# EAGLE design line5.2.2 (EAGLE 8.0.1)
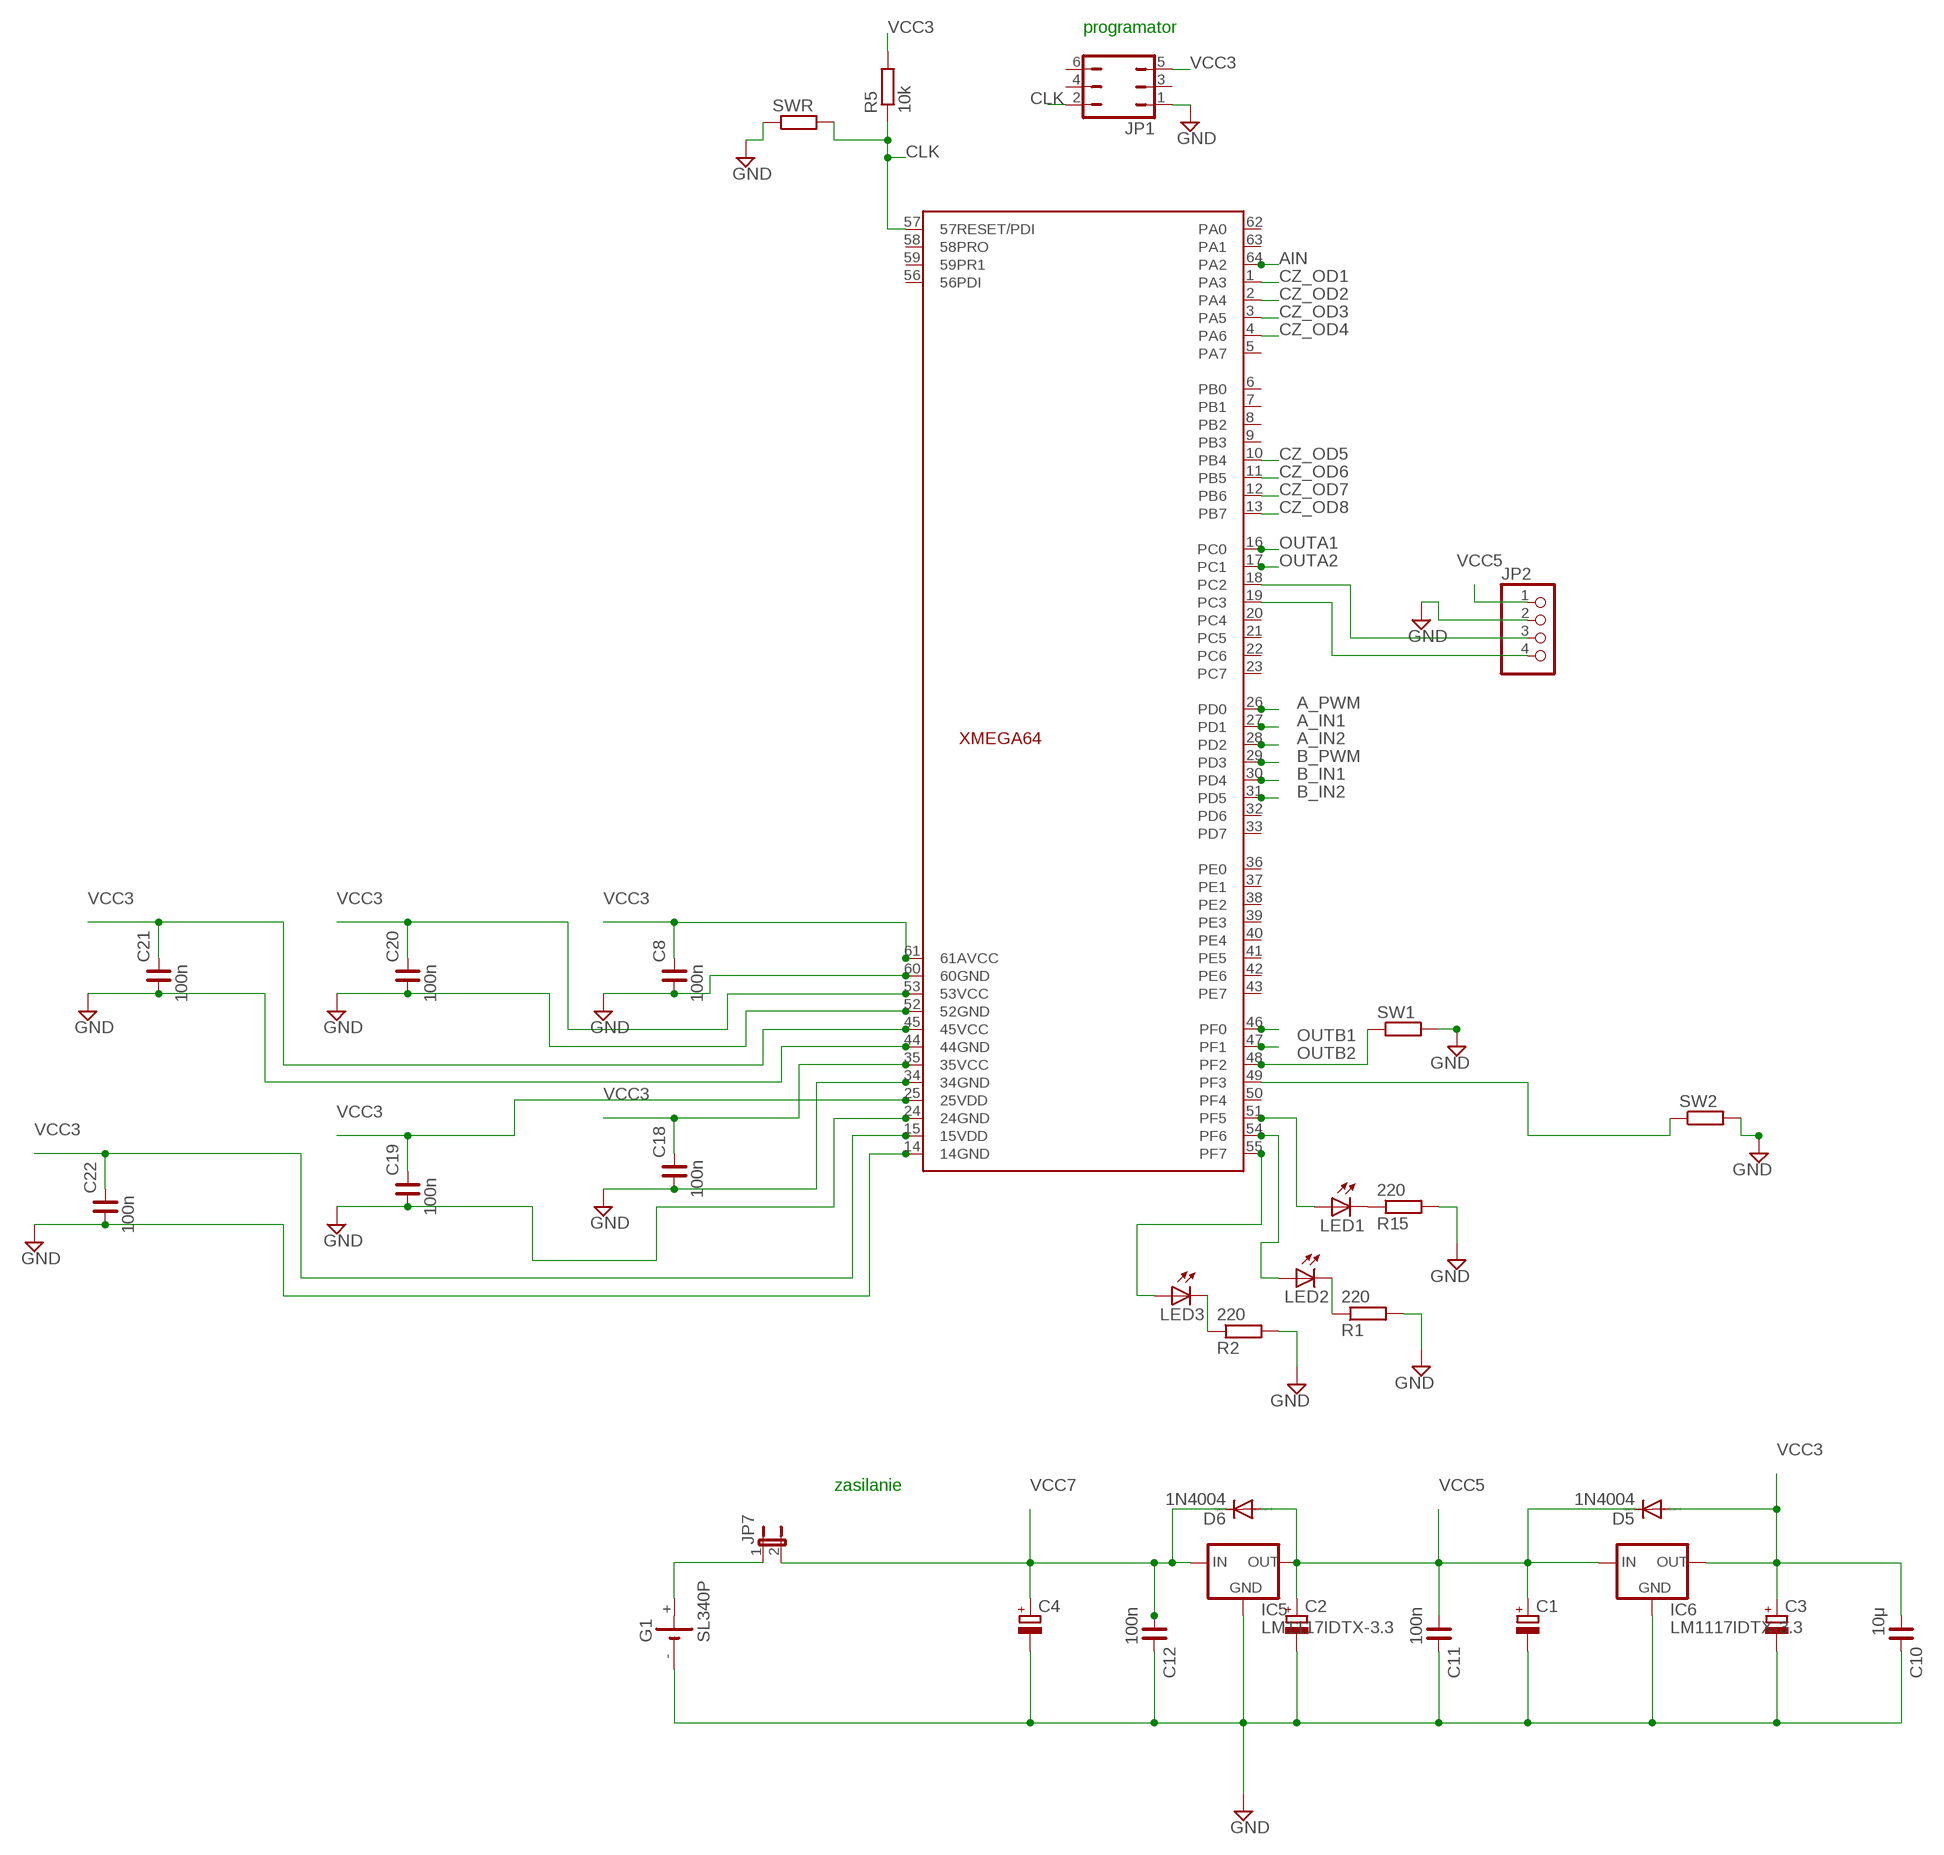
[diagram p0: schematic, sheet 1, part 1 of 2]
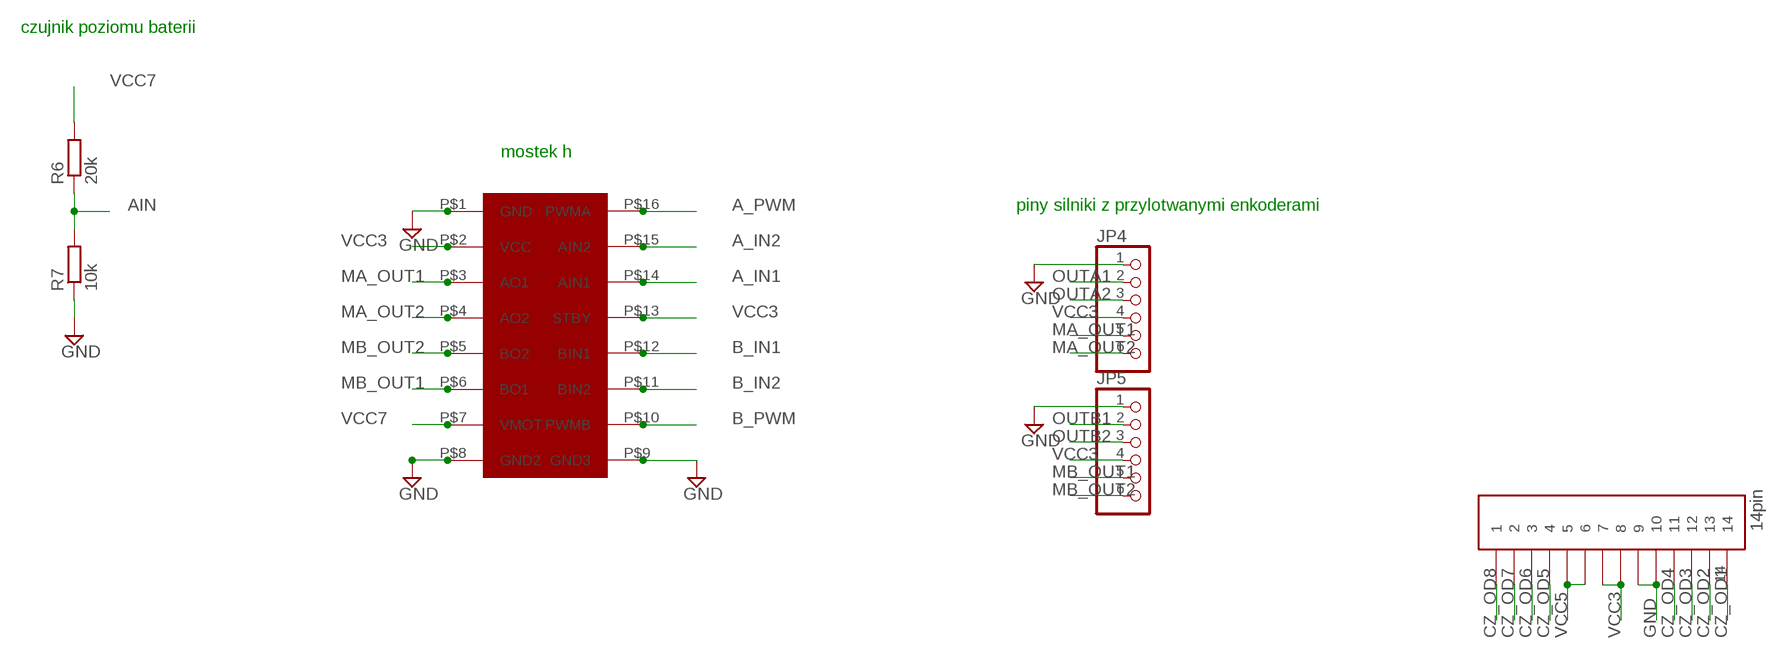
[diagram p1: schematic, sheet 1, part 2 of 2]

## Parts
C1  CPOL-EU153CLV-0810  [153CLV-0810]
C2  CPOL-EU153CLV-0810  [153CLV-0810]
C3  CPOL-EU153CLV-0810  [153CLV-0810]
C4  CPOL-EU153CLV-0810  [153CLV-0810]
C8  100n  C_1206  [C1206]
C10  10μ  C_1206  [C1206]
C11  100n  C_1206  [C1206]
C12  100n  C_1206  [C1206]
C18  100n  C_1206  [C1206]
C19  100n  C_1206  [C1206]
C20  100n  C_1206  [C1206]
C21  100n  C_1206  [C1206]
C22  100n  C_1206  [C1206]
D5  1N4004  [DO41-10]
D6  1N4004  [DO41-10]
G1  SL340P  [SL-340/P3.6V]
IC5  LM1117IDTX-3.3  [TO252]
IC6  LM1117IDTX-3.3  [TO252]
JP1  JP3Q  [JP3Q]
JP2  PINHD-1X4  [1X04]
JP4  PINHD-1X6  [1X06]
JP5  PINHD-1X6  [1X06]
JP7  JP1E  [JP1]
LED1  LEDSMT1206  [1206]
LED2  LEDSMT1206  [1206]
LED3  LEDSMT1206  [1206]
R1  220  R-EU_R0805  [R0805]
R2  220  R-EU_R0805  [R0805]
R5  10k  R-EU_R0805  [R0805]
R6  20k  R-EU_R0805  [R0805]
R7  10k  R-EU_R0805  [R0805]
R15  220  R-EU_R0805  [R0805]
SW1  R-EU_R1206  [R1206]
SW2  R-EU_R1206  [R1206]
SWR  R-EU_R1206  [R1206]
U$1  POLULU713  [POLULU713]
U$2  14PIN  [14PIN]
XMEGA64  XMEGA64C3TQFP64  [TQFP64]

## Nets
A_IN1: U$1.P$14(AIN1) XMEGA64.27(PD1)
A_IN2: U$1.P$15(AIN2) XMEGA64.28(PD2)
A_PWM [zasilanie]: U$1.P$16(PWMA) XMEGA64.26(PD0)
AIN: R6.1 R7.2 XMEGA64.64(PA2)
B_IN1: U$1.P$12(BIN1) XMEGA64.30(PD4)
B_IN2: U$1.P$11(BIN2) XMEGA64.31(PD5)
B_PWM [zasilanie]: U$1.P$10(PWMB) XMEGA64.29(PD3)
CLK: JP1.2 R5.1 SWR.2 XMEGA64.57(57RESET/PDI)
CZ_OD1: U$2.14 XMEGA64.1(PA3)
CZ_OD2: U$2.13 XMEGA64.2(PA4)
CZ_OD3: U$2.12 XMEGA64.3(PA5)
CZ_OD4: U$2.11 XMEGA64.4(PA6)
CZ_OD5: U$2.4 XMEGA64.10(PB4)
CZ_OD6: U$2.3 XMEGA64.11(PB5)
CZ_OD7: U$2.2 XMEGA64.12(PB6)
CZ_OD8: U$2.1 XMEGA64.13(PB7)
GND [zasilanie]: C1.- C2.- C3.- C4.- C8.1 C10.2 C11.2 C12.2 C18.1 C19.1 C20.1 C21.1 C22.1 G1.- IC5.1(GND) IC6.1(GND) JP1.1 JP2.2 JP4.1 JP5.1 R1.2 R2.2 R7.1 R15.2 SW1.2 SW2.2 SWR.1 U$1.P$1(GND) U$1.P$8(GND2) U$1.P$9(GND3) U$2.9 U$2.10 XMEGA64.14(14GND) XMEGA64.24(24GND) XMEGA64.34(34GND) XMEGA64.44(44GND) XMEGA64.52(52GND) XMEGA64.60(60GND)
MA_OUT1 [zasilanie]: JP4.5 U$1.P$3(AO1)
MA_OUT2 [zasilanie]: JP4.6 U$1.P$4(AO2)
MB_OUT1 [zasilanie]: JP5.5 U$1.P$6(BO1)
MB_OUT2 [zasilanie]: JP5.6 U$1.P$5(BO2)
N$1: LED1.A XMEGA64.51(PF5)
N$3: SW2.1 XMEGA64.49(PF3)
N$4: JP2.4 XMEGA64.19(PC3)
N$5: JP2.3 XMEGA64.18(PC2)
N$6: LED2.C R1.1
N$7: LED2.A XMEGA64.54(PF6)
N$8: LED3.C R2.1
N$9: LED3.A XMEGA64.55(PF7)
N$18 [zasilanie]: G1.+ JP7.1
N$26: LED1.C R15.1
OUTA1: JP4.2 XMEGA64.16(PC0)
OUTA2: JP4.3 XMEGA64.17(PC1)
OUTB1: JP5.2 XMEGA64.46(PF0)
OUTB2: JP5.3 XMEGA64.47(PF1)
SW!: SW1.1 XMEGA64.48(PF2)
VCC3 [zasilanie]: C3.+ C8.2 C10.1 C18.2 C19.2 C20.2 C21.2 C22.2 D5.A IC6.TAB(OUT) JP1.5 JP4.4 JP5.4 R5.2 U$1.P$2(VCC) U$1.P$13(STBY) U$2.7 U$2.8 XMEGA64.15(15VDD) XMEGA64.25(25VDD) XMEGA64.35(35VCC) XMEGA64.45(45VCC) XMEGA64.53(53VCC) XMEGA64.61(61AVCC)
VCC5 [zasilanie]: C1.+ C2.+ C11.1 D5.C D6.A IC5.TAB(OUT) IC6.2(IN) JP2.1 U$2.5 U$2.6
VCC7 [zasilanie]: C4.+ C12.1 D6.C IC5.2(IN) JP7.2 R6.2 U$1.P$7(VMOT)
Unconnected: JP1.3 JP1.4 JP1.6 XMEGA64.5(PA7) XMEGA64.6(PB0) XMEGA64.7(PB1) XMEGA64.8(PB2) XMEGA64.9(PB3) XMEGA64.20(PC4) XMEGA64.21(PC5) XMEGA64.22(PC6) XMEGA64.23(PC7) XMEGA64.32(PD6) XMEGA64.33(PD7) XMEGA64.36(PE0) XMEGA64.37(PE1) XMEGA64.38(PE2) XMEGA64.39(PE3) XMEGA64.40(PE4) XMEGA64.41(PE5) XMEGA64.42(PE6) XMEGA64.43(PE7) XMEGA64.50(PF4) XMEGA64.56(56PDI) XMEGA64.58(58PRO) XMEGA64.59(59PR1) XMEGA64.62(PA0) XMEGA64.63(PA1)

## Notes on the sheet
- programator
- czujnik poziomu baterii
- mostek h
- piny silniki z przylotwanymi enkoderami
- zasilanie

## Library data of the parts
C1-C4 = rcl:CPOL-EU: POLARIZED CAPACITOR, European symbol
C8 C10-C12 C18-C22 = rc-master-smd:C_: NON-POLARIZED CAP
D5 D6 = diode:1N4004: DIODE general purpose rectifier, 1 A
G1 = battery:SL340P: LI BATTERY Sonnenschein SL-340 P 3.6 V
IC5 IC6 = lm1117:LM1117IDTX-*
JP1 = jumper:JP3Q: JUMPER
JP2 = pinhead:PINHD-1X4: PIN HEADER
JP4 JP5 = pinhead:PINHD-1X6: PIN HEADER
JP7 = jumper:JP1E: JUMPER
LED1-LED3 = led:LED: LED OSRAM: - CHIPLED LG R971, LG N971, LY N971, LG Q971, LY Q971, LO R971, LY R971 LH N974, LH R974 LS Q976, LO Q976, LY Q976 LO Q996 - Hyper CHIPLED LW Q18S LB Q993, LB Q99A, LB R99A - SideLED LS A670, LO A670, LY A670, LG A670, LP A670 LB A673, LV A673, LT A673, LW A673 LH A674 LY A675 LS A676, LA A676, LO A676, LY A676, LW A676 LS A679, LY A679, LG A679 - Hyper Micro SIDELED® LS Y876, LA Y876, LO Y876, LY Y876 LT Y87S - SmartLED LW L88C, LW L88S LB L89C, LB L89S, LG L890 LS L89K, LO L89K, LY L89K LS L896, LA L896, LO L896, LY L896 - TOPLED LS T670, LO T670, LY T670, LG T670, LP T670 LSG T670, LSP T670, LSY T670, LOP T670, LYG T670 LG T671, LOG T671, LSG T671 LB T673, LV T673, LT T673, LW T673 LH T674 LS T676, LA T676, LO T676, LY T676, LB T676, LH T676, LSB T676, LW T676 LB T67C, LV T67C, LT T67C, LS T67K, LO T67K, LY T67K, LW E67C LS E67B, LA E67B, LO E67B, LY E67B, LB E67C, LV E67C, LT E67C LW T67C LS T679, LY T679, LG T679 LS T770, LO T770, LY T770, LG T770, LP T770 LB T773, LV T773, LT T773, LW T773 LH T774 LS E675, LA E675, LY E675, LS T675 LS T776, LA T776, LO T776, LY T776, LB T776 LHGB T686 LT T68C, LB T68C - Hyper Mini TOPLED® LB M676 - Mini TOPLED Santana® LG M470 LS M47K, LO M47K, LY M47K Source: http://www.osram.convergy.de LUXEON: - LUMILED® LXK2-PW12-R00, LXK2-PW12-S00, LXK2-PW14-U00, LXK2-PW14-V00 LXK2-PM12-R00, LXK2-PM12-S00, LXK2-PM14-U00 LXK2-PE12-Q00, LXK2-PE12-R00, LXK2-PE12-S00, LXK2-PE14-T00, LXK2-PE14-U00 LXK2-PB12-K00, LXK2-PB12-L00, LXK2-PB12-M00, LXK2-PB14-N00, LXK2-PB14-P00, LXK2-PB14-Q00 LXK2-PR12-L00, LXK2-PR12-M00, LXK2-PR14-Q00, LXK2-PR14-R00 LXK2-PD12-Q00, LXK2-PD12-R00, LXK2-PD12-S00 LXK2-PH12-R00, LXK2-PH12-S00 LXK2-PL12-P00, LXK2-PL12-Q00, LXK2-PL12-R00 Source: www.luxeon.com KINGBRIGHT: KA-3528ASYC Source: www.kingbright.com
R1 R2 R5-R7 R15 SW1 SW2 SWR = rcl:R-EU_: RESISTOR, European symbol
U$1 = polulu:POLULU713
U$2 = ffc_fcp(1):14PIN
XMEGA64 = atmega-atxmega:XMEGA64C3: High-performance, low-power Atmel® AVR® XMEGA® 8/16-bit Microcontroller  Nonvolatile program and data memories  64K - 256KBytes of In-System Self-Programmable Flash  4K - 8KBytes Boot Code Section with Independent Lock Bits  2K - 4KBytes EEPROM  4K - 16KBytes Internal SRAM  Peripheral features  Four-channel event system  Five 16-bit timer/counters  Four timer/counters with four output compare or input capture channels  One timer/counter with two output compare or input capture channels  High resolution extension on two timer/counters  Advanced waveform extension (AWeX) on one timer/counter  One USB device interface  USB 2.0 full speed (12Mbps) and low speed (1.5Mbps) device compliant  32 Endpoints with full configuration flexibility  Three USARTs with IrDA support for one USART  Two two-wire interfaces with dual address match (I2C and SMBus compatible)  Two serial peripheral interfaces (SPIs)  CRC-16 (CRC-CCITT) and CRC-32 (IEEE®802.3) generator  16-bit real time counter (RTC) with separate oscillator  One sixteen-channel, 12-bit, 300ksps Analog to Digital Converter  Two Analog Comparators with window compare function, and current sources  External interrupts on all general purpose I/O pins  Programmable watchdog timer with separate on-chip ultra low power oscillator  QTouch® library support  Capacitive touch buttons, sliders and wheels  Special microcontroller features  Power-on reset and programmable brown-out detection  Internal and external clock options with PLL and prescaler  Programmable multilevel interrupt controller  Five sleep modes  Programming and debug interface  PDI (program and debug interface)  I/O and packages  50 programmable I/O pins  64-lead TQFP  64-pad QFN  Operating voltage  1.6 – 3.6V  Operating frequency  0 – 12MHz from 1.6V  0 – 32MHz from 2.7V

## Net classes
0 default: width 0.305 mm
1 zasilanie: width 0.406 mm

## Board
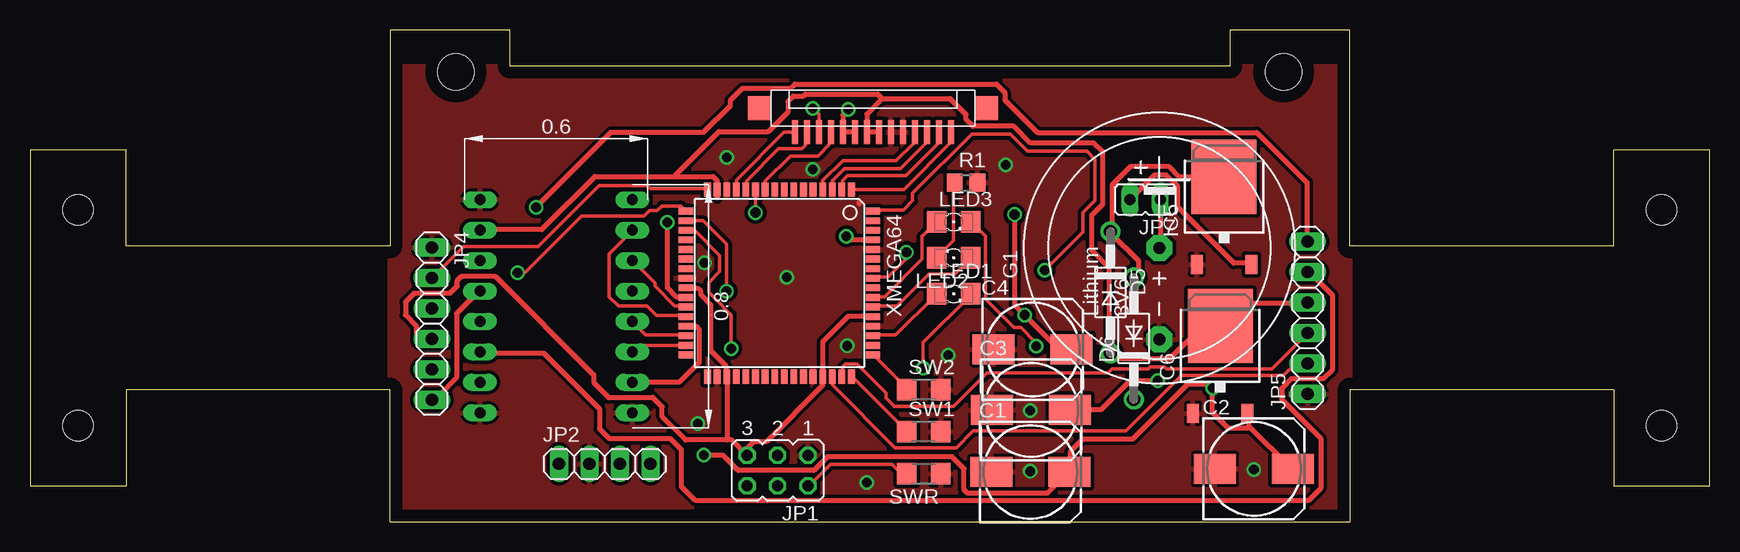
[diagram p2: board, top side]
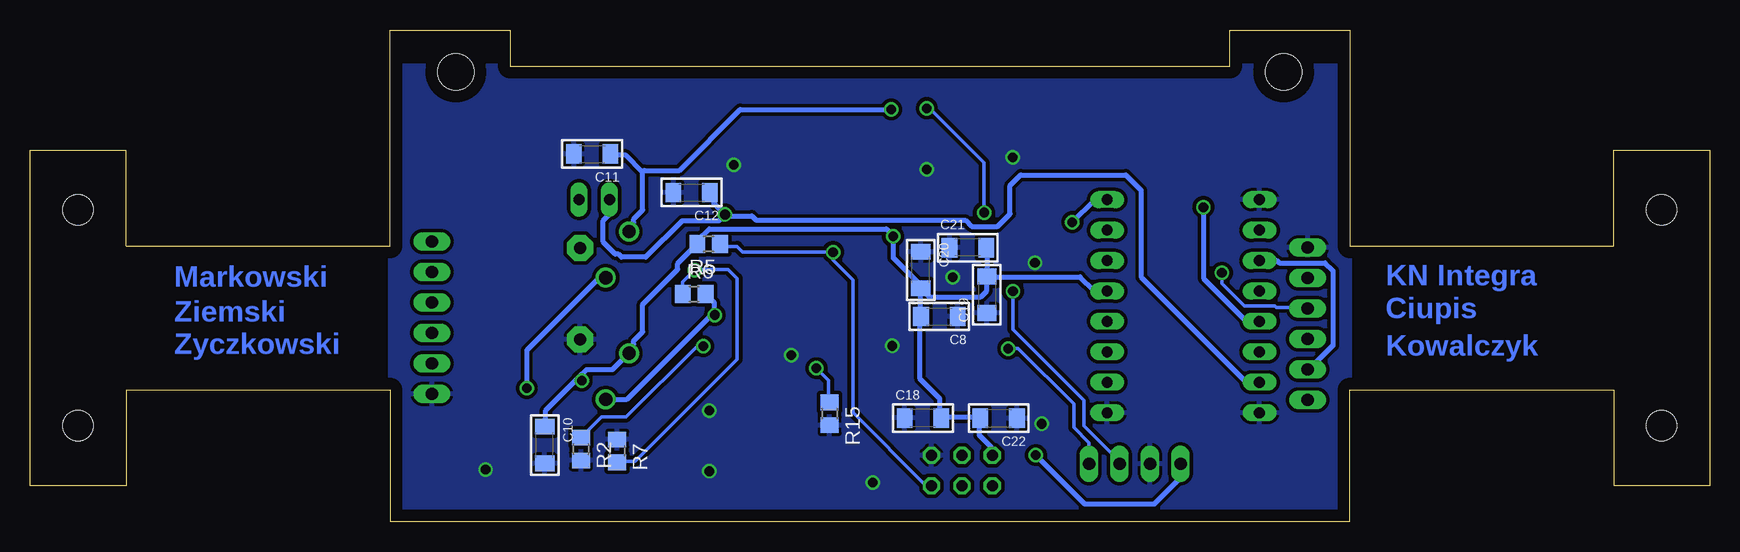
[diagram p3: board, bottom side, seen from below]

Size 140 x 41 mm. Coordinates in mm from the lower left corner, seen from the top.
Outline: 0,3 8,3 8,11 30,11 30,0 110,0 110,11 132,11 132,3 140,3 140,31 132,31 132,23 110,23 110,41 100,41 100,38 40,38 40,41 30,41 30,23 8,23 8,31 0,31 0,3
Copper layers (1*16): Top 0.035mm / dielectric 1.5mm / Bottom 0.035mm
Design rules "default": minimum track width 10mil, minimum drill 24mil, track to track 8mil, track to pad 8mil, pad to pad 8mil, via to via 8mil, smd to smd 8mil, copper to edge 40mil, drill to drill 8mil, minimum pad ring 10mil, minimum via ring 8mil, stop-mask expansion 4mil, vias tented up to drill 0mil, thermal gap 10mil
Holes 2.5 mm at 4,8 4,26 136,8 136,26
Holes 3 mm at 35.5,37.5 104.5,37.5

### Footprints (pad centres in the part's own frame; a part is rotated, then mirrored left to right if it is on the bottom)
153CLV-0810 = smd 3.5 x 2.5: + 3.25,0; - -3.25,0
C1206 = smd 1.3 x 1.6: 1 -1.524,0; 2 1.524,0
DO41-10 = drill 1.118: A 5.08,0; C -5.08,0
SL-340/P3.6V = drill 1.016 pad 2.159 octagon: + 0,0; - -7.62,0
TO252 = smd 1 x 1.6: 1 -2.28,-4.8; 2 2.28,-4.8 | smd 5.4 x 6.2: TAB 0,2.5
JP3Q = drill 0.914 octagon: 1 -2.54,-1.27; 2 -2.54,1.27; 3 0,-1.27; 4 0,1.27; 5 2.54,-1.27; 6 2.54,1.27
1X04 = drill 1.016 long: 1 -3.81,0; 2 -1.27,0; 3 1.27,0; 4 3.81,0
1X06 = drill 1.016 long: 1 -6.35,0; 2 -3.81,0; 3 -1.27,0; 4 1.27,0; 5 3.81,0; 6 6.35,0
JP1 = drill 0.914 long: 1 0,-1.27; 2 0,1.27
1206 = smd 1.6 x 1.803: A -1.422,0; C 1.422,0
R0805 = smd 1.3 x 1.5: 1 -0.95,0; 2 0.95,0
R1206 = smd 1.6 x 1.803: 1 -1.422,0; 2 1.422,0
POLULU713 = drill 0.9 long: P$1 -13.97,3.81; P$2 -13.97,1.27; P$3 -13.97,-1.27; P$4 -13.97,-3.81; P$5 -13.97,-6.35; P$6 -13.97,-8.89; P$7 -13.97,-11.43; P$8 -13.97,-13.97; P$9 -1.27,-13.97; P$10 -1.27,-11.43; P$11 -1.27,-8.89; P$12 -1.27,-6.35; P$13 -1.27,-3.81; P$14 -1.27,-1.27; P$15 -1.27,1.27; P$16 -1.27,3.81
14PIN = smd 2 x 0.5: 1 -1.5,6.23; 2 -1.5,5.23; 3 -1.5,4.23; 4 -1.5,3.23; 5 -1.5,2.23; 6 -1.5,1.23; 7 -1.5,0.23; 8 -1.5,-0.77; 9 -1.5,-1.77; 10 -1.5,-2.77; 11 -1.5,-3.77; 12 -1.5,-4.77; 13 -1.5,-5.77; 14 -1.5,-6.77 | smd 2 x 1.8: 19 0.5,9.23; 20 0.5,-9.77
TQFP64 = smd 1.194 x 0.559: 1 -7.8,6; 2 -7.8,5.2; 3 -7.8,4.4; 4 -7.8,3.6; 5 -7.8,2.8; 6 -7.8,2; 7 -7.8,1.2; 8 -7.8,0.4; 9 -7.8,-0.4; 10 -7.8,-1.2; 11 -7.8,-2; 12 -7.8,-2.8; 13 -7.8,-3.6; 14 -7.8,-4.4; 15 -7.8,-5.2; 16 -7.8,-6; 33 7.8,-6; 34 7.8,-5.2; 35 7.8,-4.4; 36 7.8,-3.6; 37 7.8,-2.8; 38 7.8,-2; 39 7.8,-1.2; 40 7.8,-0.4; 41 7.8,0.4; 42 7.8,1.2; 43 7.8,2; 44 7.8,2.8; 45 7.8,3.6; 46 7.8,4.4; 47 7.8,5.2; 48 7.8,6 | smd 0.559 x 1.194: 17 -6,-7.8; 18 -5.2,-7.8; 19 -4.4,-7.8; 20 -3.6,-7.8; 21 -2.8,-7.8; 22 -2,-7.8; 23 -1.2,-7.8; 24 -0.4,-7.8; 25 0.4,-7.8; 26 1.2,-7.8; 27 2,-7.8; 28 2.8,-7.8; 29 3.6,-7.8; 30 4.4,-7.8; 31 5.2,-7.8; 32 6,-7.8; 49 6,7.8; 50 5.2,7.8; 51 4.4,7.8; 52 3.6,7.8; 53 2.8,7.8; 54 2,7.8; 55 1.2,7.8; 56 0.4,7.8; 57 -0.4,7.8; 58 -1.2,7.8; 59 -2,7.8; 60 -2.8,7.8; 61 -3.6,7.8; 62 -4.4,7.8; 63 -5.2,7.8; 64 -6,7.8

### Placement (x,y rotation side)
C1  83.39,4.13 0 top
C2  102.03,4.39 0 top
C3  83.45,9.32 0 top
C4  83.58,14.36 0 top
C8  64.2,17.1 180 bottom
C10  97.09,6.38 270 bottom
C11  93.14,30.66 180 bottom
C12  84.85,27.45 180 bottom
C18  65.56,8.63 0 bottom
C19  60.24,18.92 90 bottom
C20  65.75,20.97 270 bottom
C21  61.83,22.84 0 bottom
C22  59.25,8.62 180 bottom
D5  90.06,19.11 270 top
D6  92.02,15.27 90 top
G1  94.14,22.81 90 top
IC5  99.53,26.25 0 top
IC6  99.22,13.81 0 top
JP1  62.33,4.26 180 top
JP2  47.9,4.81 0 top
JP4  33.5,16.5 270 top
JP5  106.5,17 90 top
JP7  92.98,26.86 90 top
LED1  77,19 0 top
LED2  77,22 180 top
LED3  77,25 0 top
R1  78.03,28.26 0 top
R2  94.08,6.05 270 bottom
R5  83.43,23.14 180 bottom
R6  84.64,18.98 0 bottom
R7  91.06,5.89 270 bottom
R15  73.35,8.99 270 bottom
SW1  74.5,7.5 0 top
SW2  74.5,11 0 top
SWR  74.5,4 180 top
U$1  51.48,23.04 0 top
U$2  70,34 90 top
XMEGA64  62.48,19.89 270 top

### Tracks (layer width: path | path; a pad name or v marks a point on that pad's centre or on a via)
A_IN1
  Top 0.305: XMEGA64.27 54.63,17.99 53.74,17.99 52.09,19.64 52.09,19.89 50.31,21.67 U$1.P$14
A_IN2
  Top 0.305: 54.63,17.1 XMEGA64.28 54.6,17.17 52.22,17.17 51.43,17.96 49.07,17.96 48.28,18.75 48.28,22.3 50.19,24.21 U$1.P$15
A_PWM  (via drill 0.8)
  Top 0.406: v53.11,24.97 53.11,19.51 53.87,18.75 54.63,18.75 XMEGA64.26
  Bottom 0.406: v53.11,24.97 51.33,26.75 50.31,26.75 U$1.P$16
AIN  (via drill 0.8)
  Top 0.305: XMEGA64.64 70.38,25.99 72.79,25.99 73.58,26.77 73.58,27.39 78.51,32.32 81.72,32.32 83.16,30.88 88.09,30.88 88.77,30.2 88.77,26.78 87.78,25.79 87.78,24.16 v84.59,20.97
  Bottom 0.305: R7.2 90.95,5.03 89.56,5.03 81.05,13.54 81.05,20.27 81.81,21.03 84.52,21.03 v84.59,20.97 85.59,19.96 R6.1
B_IN1
  Top 0.305: XMEGA64.30 54.63,15.57 51.33,15.57 50.31,16.59 U$1.P$12
B_IN2
  Top 0.305: XMEGA64.31 54.63,14.68 50.82,14.68 50.31,14.18 U$1.P$11
B_PWM
  Top 0.406: XMEGA64.29 54.75,16.3 55.51,16.3 55.78,16.03 55.78,13.28 54.13,11.64 50.31,11.64 U$1.P$10
CLK  (via drill 0.8)
  Top 0.305: 73.05,3.89 SWR.2 72.65,4 71.87,4.78 66.73,4.78 64.94,2.99 JP1.2 | XMEGA64.57 70.38,20.4 71.52,20.4 73.06,21.93 v73.06,22.47
  Bottom 0.305: R5.1 82.45,23.07 82.32,22.94 81.05,22.94 80.58,22.47 v73.06,22.47 73.06,21.81 71.4,20.14 71.4,9.1 65.3,3 64.92,3 JP1.2
CZ_OD1
  Top 0.305: 68.6,27.77 XMEGA64.1 72.83,27.7 76.77,31.63 76.73,32.46 U$2.14
CZ_OD2
  Top 0.305: XMEGA64.2 67.71,27.77 67.71,28.45 68.13,28.87 73.01,28.87 75.72,31.57 75.72,32.46 U$2.13
CZ_OD3
  Top 0.305: XMEGA64.3 66.89,27.75 66.89,28.44 66.9,28.44 67.9,29.44 72.56,29.44 74.7,31.57 74.7,32.46 U$2.12
CZ_OD4
  Top 0.305: 66.08,27.73 XMEGA64.4 66.08,28.41 66.07,28.42 67.77,30.12 72.19,30.12 72.21,30.1 73.68,31.57 73.68,32.46 U$2.11
CZ_OD5
  Top 0.305: XMEGA64.10 61.27,27.75 61.27,28.38 63.39,30.5 65.68,30.5 66.7,31.52 66.7,32.46 U$2.4
CZ_OD6  (via drill 0.8)
  Top 0.305: v60.48,25.77 60.48,27.64 XMEGA64.11 | 65.77,33.41 65.77,32.65 U$2.3 65.77,33.97 65.27,34.47 v65.24,34.47
  Bottom 0.305: v60.48,25.77 60.48,29.92 65.02,34.47 v65.24,34.47
CZ_OD7
  Top 0.305: XMEGA64.12 59.71,27.77 59.71,28.4 62.4,31.09 64.35,31.09 64.67,31.41 64.67,32.46 U$2.2
CZ_OD8
  Top 0.305: 58.95,27.77 XMEGA64.13 58.88,28.48 62.87,32.46 63.65,32.46 U$2.1
GND  (via drill 0.8)
  Top 0.406: 69.12,26.67 69.11,26.51
  other vias: 56.23,21.59 58.09,30.38 65.24,29.37 68.12,14.65 76.53,13.88 83.36,9.24 83.39,4.19 69.74,3.26 102.02,4.34 55.67,8.15 81.32,29.74 63.08,20.37
  pour Bottom (isolate 0.305): 30,38 110,38 110,0 30,0
  pour Top (isolate 0.305): 31,33 56,33 56,37 84,37 84,33 109,33 109,1 31,1
  pour Top (isolate 0.305): 30,38 110,38 110,0 30,0
MA_OUT1
  Bottom 0.406: 37.49,21.67 U$1.P$3 36.06,21.77 35.87,21.57 32.04,21.57 31.39,20.92 31.39,14.68 33.42,12.65 JP4.5
MA_OUT2
  Top 0.406: 37.49,19.13 U$1.P$4 37.45,19.23 35.56,17.34 35.56,12.01 34,10.45 33.8,10.45 JP4.6 33.55,10.11
MB_OUT1
  Top 0.406: U$1.P$6 37.62,14.05 42.82,14.05 47.46,9.41 47.46,7.75 48.27,6.94 53.36,6.94 54.3,6 54.3,2.91 55.48,1.73 106.55,1.73 107.6,2.78 107.6,6.92 104.35,10.17 104.35,11.12 105.15,11.92 107.83,11.92 108.56,12.65 108.59,12.65 108.59,18.87 106.65,20.81 JP5.5 106.58,20.78
MB_OUT2  (via drill 0.8)
  Top 0.406: JP5.6 106.45,23.45 106.45,28.27 106.44,28.27 102.27,32.44 83.98,32.44 81.27,35.15 81.27,35.79 80.56,36.49 63.76,36.49 63.41,36.14 59.38,36.14 58.38,35.14 58.38,34.69 56.16,32.46 48.43,32.46 v42.19,26.22
  Bottom 0.406: v42.19,26.22 42.19,20.27 38.63,16.72 37.62,16.72 U$1.P$5
N$1
  Top 0.305: XMEGA64.51 70.38,15.57 72.16,15.57 75.46,18.88 LED1.A
N$3
  Top 0.305: XMEGA64.49 70.38,13.79 73.17,11 SW2.1
N$4  (via drill 0.8)
  Top 0.305: XMEGA64.19 54.76,24.3 55.39,24.3 57.49,22.2 57.49,20.84 56.6,19.95 56.6,19.11 57.08,18.63 57.07,18.63 58.46,17.25 v58.46,14.43
  Bottom 0.305: 51.71,5.54 51.71,4.91 JP2.4 51.71,6.55 53,7.84 53,9.8 57.63,14.43 v58.46,14.43
N$5  (via drill 0.8)
  Top 0.305: XMEGA64.18 54.76,25.1 55.44,25.09 56.11,25.09 58.06,23.14 v58.06,19.2
  Bottom 0.305: 49.17,4.91 JP2.3 49.17,5.01 52.16,8 52.16,10.12 58.07,16.03 58.06,16.04 v58.06,19.2
N$6
  Top 0.305: R1.1 76.98,28.15 76.98,23.45 75.59,22.05 LED2.C
N$7
  Top 0.305: XMEGA64.54 70.38,17.99 72.29,17.99 74.95,20.65 77.11,20.65 78.38,21.92 LED2.A
N$8  (via drill 0.8)
  Top 0.305: LED3.C 78.51,24.97 79.65,23.83 79.65,18.57 82.03,16.19 82.59,16.19 83.87,14.91 v83.87,14.62
  Bottom 0.305: R2.1 94,7.06 92.35,8.71 90.32,8.71 84.41,14.62 v83.87,14.62
N$9
  Top 0.305: XMEGA64.55 70.38,18.75 71.22,18.75 74.37,21.89 74.37,23.8 74.38,23.8 LED3.A 75.46,24.97
N$18
  Top 0.406: JP7.1 94.26,26.75 94.26,22.81 G1.+
N$26  (via drill 0.8)
  Top 0.305: v74.44,12.79 74.44,14.94 78.38,18.88 LED1.C
  Bottom 0.305: R15.1 73.43,9.98 73.43,11.77 v74.44,12.79
OUTA1
  Top 0.305: XMEGA64.16 56.41,27.77 51.71,27.77 51.46,28.02 47.43,28.02 42.34,22.93 36.17,22.93 36.16,22.94 33.53,20.31 JP4.2 33.58,20.37
OUTA2  (via drill 0.8)
  Top 0.305: 54.66,25.93 XMEGA64.17 54.25,26.32 52.67,26.32 52.28,25.93 51.66,25.93 51.2,25.48 46,25.48 41.28,20.76 v40.65,20.76
  Bottom 0.305: JP4.3 33.55,17.86 36.12,17.86 36.23,17.96 38.77,17.96 40.65,19.84 v40.65,20.76
OUTB1
  Top 0.305: XMEGA64.46 66.88,12.02 66.88,11.38 72.11,6.15 77.22,6.15 78.62,7.55 91.36,7.55 95.99,12.18 104.49,12.18 105.47,13.16 106.45,13.16 JP5.2
OUTB2
  Top 0.305: XMEGA64.47 67.71,12.14 67.71,12.88 68,13.16 68.94,13.16 71.35,10.75 71.35,10.31 72.03,9.63 72.03,9.61 76.98,9.61 79.78,12.41 89.85,12.41 90.19,12.75 93.21,12.75 93.36,12.9 94.56,12.9 94.71,12.75 103.52,12.75 JP5.3 106.45,15.7
SW!
  Top 0.305: XMEGA64.48 68.6,12.02 73.05,7.57 SW1.1
VCC3  (via drill 0.8)
  Top 0.406: 59.71,5.54 JP1.5 | 54.73,19.48 XMEGA64.25 54.74,19.43 55.7,19.43 55.92,19.21 55.92,18.92 56.77,18.07 56.77,14.21 58.06,12.92 58.06,12.27 XMEGA64.35 58.12,11.88 58.12,6.8 | JP5.4 106.45,18.24 101.24,18.24 99.34,16.34 IC6.TAB 99.08,16.21 97.65,16.21 | C3.+ 86.76,9.35 89.3,9.35 91.72,11.76 v94,11.76 | 97.65,16.21 97.31,16.21 | U$2.8 70.76,32.46 69.87,32.46 U$2.7 69.76,34 71.04,35.28 | XMEGA64.53 70.25,17.1 68.19,17.1 66.08,14.99 XMEGA64.45 66.08,11.85 66.08,11.34 61.44,6.7 60.37,6.7 59.79,6.12 JP1.5 | 57.3,27 57.3,27.64 XMEGA64.15 57.3,27.89 57.3,28.4 56.92,28.78 53.69,28.78 | 37.62,24.34 U$1.P$2 37.55,24.35 42.65,24.35 47.09,28.79 53.68,28.79 53.69,28.78 | 53.69,28.78 57.45,32.54 61.57,32.54 63.18,34.15 63.18,35.05 63.63,35.5 64.47,35.5 64.63,35.66 70.66,35.66 71.04,35.28 | 70.25,23.45 XMEGA64.61 68.36,23.49 v68.06,23.79 | JP1.5 58.52,6.8 58.12,6.8 | 58.12,6.8 54.63,6.8 52.69,8.74 52.69,9.58 51.9,10.37 48.16,10.37 48.16,10.43 46.98,11.61 46.98,12.25 38.76,20.47 35.99,20.47 35.61,20.09 35.61,19.63 35.02,19.04 32.04,19.04 31.3,18.3 31.3,17.22 32.19,16.33 32.19,15.62 32.5,15.31 33.42,15.31 JP4.4 | 97.65,16.21 95.04,13.6 90.33,13.6 90.07,13.92 D5.A 89.94,14.18 89.94,21.16 88.51,22.59 88.51,25.55 89.42,26.46 89.42,30.8 88.65,31.57 83.4,31.57 82,32.97 78.6,32.97 78.03,33.54 78.03,33.95 76.7,35.28 71.04,35.28
  Bottom 0.406: C20.2 65.81,19.38 65.81,17.22 C8.2 65.81,16.97 65.81,11.89 64.16,10.24 64.16,8.84 C18.2 64.03,8.71 60.86,8.71 C22.2 60.86,8.46 60.86,7.19 59.84,6.17 59.84,5.54 JP1.5 | C19.2 60.22,20.53 60.22,22.81 C21.2 | U$1.P$13 50.31,19.26 51.33,19.26 52.47,20.4 60.09,20.4 C19.2 | R5.2 84.48,23.07 | 94.26,12.02 93.62,12.65 91.46,12.65 90.19,13.92 D5.A 89.94,14.05 89.94,14.56 89.69,14.81 89.69,15.06 88.92,15.83 88.92,18.11 86,21.03 86,21.52 R5.2 | 94.26,12.02 97.05,9.22 97.05,7.95 C10.1 | v94,11.76 94.26,12.02 | C20.2 65.68,19.64 68.06,22.01 v68.06,23.79 68.06,23.85 68.62,24.42 83.36,24.42 84.38,23.39 R5.2 | 84.35,23.32 R5.2 | C20.2 65.04,18.74 60.73,18.74 60.24,19.23 C19.2
VCC5  (via drill 0.8)
  Top 0.406: U$2.6 68.73,32.46 67.84,32.46 U$2.5 67.77,33.93 v68.21,34.37 | D5.C 90.07,24.08 92.39,21.76 92.39,20.77 92.02,20.4 D6.A | IC5.TAB 99.46,28.78 95.78,28.78 94.97,29.59 91.71,29.59 90.19,28.07 90.19,24.31 D5.C | 90.19,24.34 D5.C | 101.62,7.95 101.62,8.97 IC6.2 | 101.62,7.95 105.18,4.4 C2.+ | C1.+ 86.64,4.02 | 86.76,4.27 C1.+ | 101.62,7.95 101.48,7.81 99.86,7.81 98.58,9.09 v98.58,11.12 98.26,11.44 98.26,11.45 96.49,11.45 91.92,6.88 87.78,6.88 86.7,5.8 86.7,4.19 C1.+ | v56.16,5.54 56.18,5.52 57.78,5.52 59.03,4.27 65.34,4.27 66.48,5.41 76.86,5.41 77.87,4.4 77.87,2.64 78.11,2.4 84.85,2.4 86.58,4.13 C1.+
  Bottom 0.406: 88.92,29.16 90.32,30.56 91.59,30.56 C11.1 | 88.92,29.16 88.92,25.99 89.69,25.23 89.69,24.97 89.94,24.72 89.94,24.21 D5.C | 88.92,29.16 88.8,29.29 85.88,29.29 80.79,34.37 v68.21,34.37 | v56.16,5.54 52.09,1.48 46.25,1.48 44.09,3.63 44.09,4.78 JP2.1 | v98.58,11.12 98.58,14.3 92.35,20.53 92.19,20.53 D6.A
VCC7  (via drill 0.8)
  Top 0.406: IC5.2 101.75,21.54 100.35,21.54 95.67,26.23 95.67,27.93 94.69,28.91 93.75,28.91 91.72,26.88 JP7.2 | 86.76,14.43 C4.+ 85.78,14.36 v82.91,17.23 82.06,18.08 v82.06,25.61
  Bottom 0.406: U$1.P$7 37.62,11.64 38.63,11.64 47.39,20.4 47.39,27.64 48.66,28.91 57.43,28.91 58.3,28.04 58.3,25.66 59.34,24.62 61.51,24.62 62.03,25.14 79.47,25.14 79.83,25.5 82,25.5 v82.06,25.61 | v82.06,25.61 82.57,25.1 85.62,25.1 88.67,22.05 90.7,22.05 90.95,22.3 91.21,22.3 92.22,23.32 92.22,25.1 91.72,25.61 91.72,26.75 JP7.2 | C12.1 83,27 83,26.54 v82.06,25.61 | D6.C 90.24,10.19 83.2,17.23 v82.91,17.23 82.95,17.27 82.95,18.24 R6.2

### Text on the board
Bottom: KN Integra | Ciupis | Markowski | Ziemski | Kowalczyk | Zyczkowski